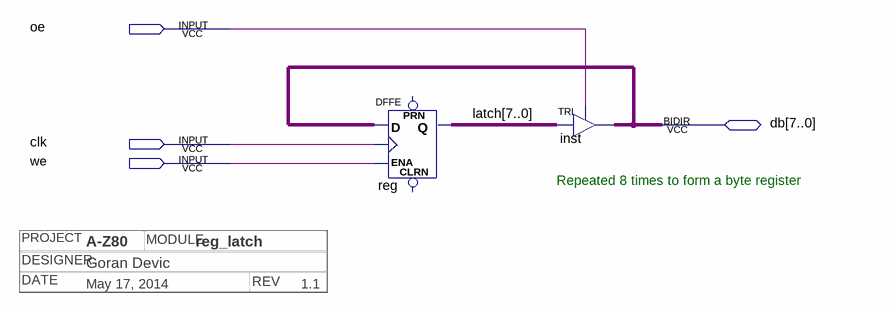
[diagram p0: schematic sheet]
// Quartus schematic reg_latch.bdf as structural Verilog: 2 symbols, 4 pins
// Title block: PROJECT: A-Z80; MODULE: reg_latch; DESIGNER: Goran Devic; DATE: May 17, 2014; REV: 1.1
module reg_latch (
  input  oe,
  input  clk,
  input  we,
  inout  [7:0] db
);

  wire [7:0] latch;

  DFFE \reg [7:0] (.D(db), .CLK(clk), .ENA(we), .Q(latch));  // open: PRN, CLRN
  TRI inst[7:0] (.IN(latch), .OE(oe), .OUT(db));

  // Notes on the sheet:
  //   Repeated 8 times to form a byte register
endmodule
